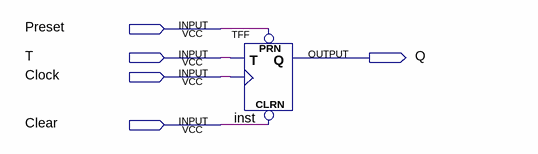
[diagram p0: schematic sheet]
// Quartus schematic FLIPFLOP_T.bdf as structural Verilog: 1 symbols, 5 pins
module FLIPFLOP_T (
  input  Preset,
  input  T,
  input  Clock,
  input  Clear,
  output Q
);

  TFF inst (.PRN(Preset), .CLRN(Clear), .T(T), .CLK(Clock), .Q(Q));
endmodule
